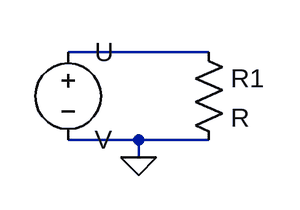
[diagram p0: schematic p2.asc]
p2.asc, the LTspice schematic file:
Version 4
SHEET 1 880 680
WIRE 160 96 32 96
WIRE 96 176 32 176
WIRE 160 176 96 176
WIRE 96 192 96 176
FLAG 96 192 0
SYMBOL res 144 80 R0
SYMATTR InstName R1
SYMBOL voltage 32 80 R0
SYMATTR InstName U

The netlist it stands for:
* p2.asc
R1 N001 0 R
V§U N001 0 V
.backanno
.end